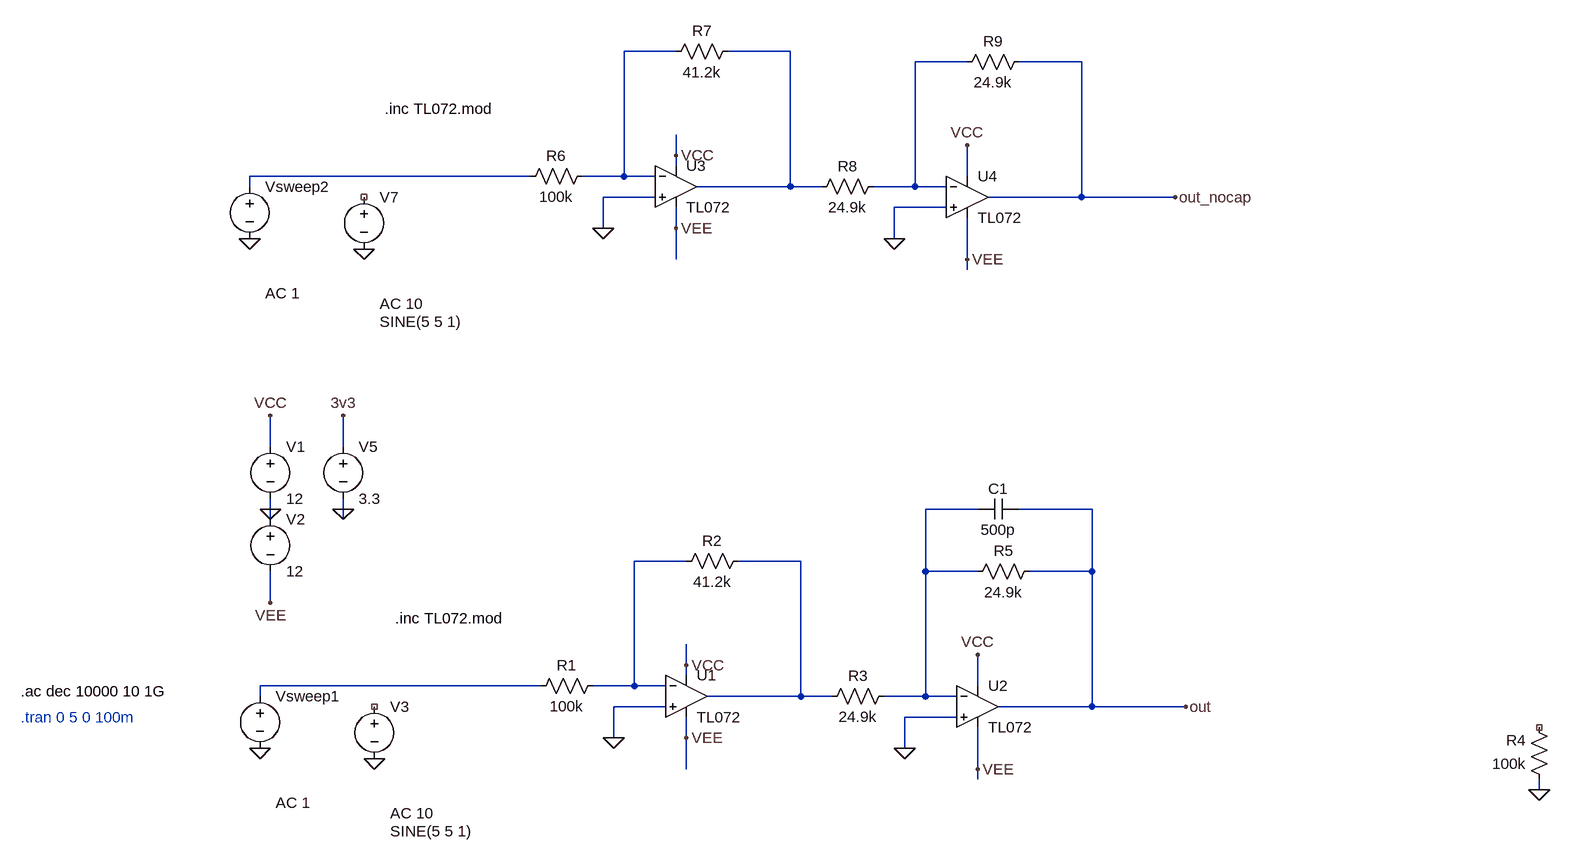
[diagram p0: schematic CV_in.asc]
CV_in.asc, the LTspice schematic file:
Version 4
SHEET 1 1540 680
WIRE 192 -832 112 -832
WIRE 368 -832 272 -832
WIRE 640 -816 560 -816
WIRE 816 -816 720 -816
WIRE 192 -672 192 -704
WIRE 192 -656 192 -672
WIRE -32 -640 -464 -640
WIRE 112 -640 112 -832
WIRE 112 -640 48 -640
WIRE 160 -640 112 -640
WIRE 640 -640 640 -688
WIRE -464 -624 -464 -640
WIRE 368 -624 368 -832
WIRE 368 -624 224 -624
WIRE 416 -624 368 -624
WIRE 560 -624 560 -816
WIRE 560 -624 496 -624
WIRE 608 -624 560 -624
WIRE 160 -608 80 -608
WIRE 816 -608 816 -816
WIRE 816 -608 672 -608
WIRE 960 -608 816 -608
WIRE 608 -592 528 -592
WIRE 80 -560 80 -608
WIRE 192 -560 192 -592
WIRE 528 -544 528 -592
WIRE 192 -512 192 -560
WIRE 640 -512 640 -576
WIRE 640 -496 640 -512
WIRE -432 -224 -432 -272
WIRE -320 -224 -320 -272
WIRE -432 -128 -432 -144
WIRE -320 -128 -320 -144
WIRE 656 -128 576 -128
WIRE 832 -128 720 -128
WIRE -432 -112 -432 -128
WIRE -320 -112 -320 -128
WIRE 208 -48 128 -48
WIRE 384 -48 288 -48
WIRE 576 -32 576 -128
WIRE 656 -32 576 -32
WIRE 832 -32 832 -128
WIRE 832 -32 736 -32
WIRE -432 16 -432 -32
WIRE 208 112 208 80
WIRE 208 128 208 112
WIRE -16 144 -448 144
WIRE 128 144 128 -48
WIRE 128 144 64 144
WIRE 176 144 128 144
WIRE 656 144 656 96
WIRE -448 160 -448 144
WIRE 384 160 384 -48
WIRE 384 160 240 160
WIRE 432 160 384 160
WIRE 576 160 576 -32
WIRE 576 160 512 160
WIRE 624 160 576 160
WIRE 176 176 96 176
WIRE 832 176 832 -32
WIRE 832 176 688 176
WIRE 976 176 832 176
WIRE 624 192 544 192
WIRE 96 224 96 176
WIRE 208 224 208 192
WIRE 544 240 544 192
WIRE 208 272 208 224
WIRE 656 272 656 208
WIRE 656 288 656 272
WIRE 1520 304 1520 288
FLAG -432 -128 0
FLAG -432 -272 VCC
FLAG -432 16 VEE
FLAG 208 112 VCC
FLAG 208 224 VEE
FLAG 96 224 0
FLAG -448 240 0
FLAG -272 256 0
FLAG 1520 304 0
FLAG 544 240 0
FLAG -320 -128 0
FLAG -320 -272 3v3
FLAG 656 272 VEE
FLAG 656 96 VCC
FLAG 192 -672 VCC
FLAG 192 -560 VEE
FLAG 80 -560 0
FLAG -464 -544 0
FLAG -288 -528 0
FLAG 528 -544 0
FLAG 640 -512 VEE
FLAG 640 -688 VCC
FLAG 976 176 out
FLAG 960 -608 out_nocap
DATAFLAG 912 176 ""
SYMBOL Opamps\\opamp2 208 96 R0
SYMATTR InstName U1
SYMATTR Value TL072
SYMBOL voltage -432 -240 R0
WINDOW 123 0 0 Left 0
WINDOW 39 0 0 Left 0
SYMATTR InstName V1
SYMATTR Value 12
SYMBOL voltage -432 -128 R0
WINDOW 123 0 0 Left 0
WINDOW 39 0 0 Left 0
SYMATTR InstName V2
SYMATTR Value 12
SYMBOL res 80 128 R90
WINDOW 0 0 56 VBottom 2
WINDOW 3 32 56 VTop 2
SYMATTR InstName R1
SYMATTR Value 100k
SYMBOL res 304 -64 R90
WINDOW 0 0 56 VBottom 2
WINDOW 3 32 56 VTop 2
SYMATTR InstName R2
SYMATTR Value 41.2k
SYMBOL voltage -448 144 R0
WINDOW 3 24 152 Left 2
WINDOW 123 24 180 Left 2
WINDOW 39 0 0 Left 0
SYMATTR Value ""
SYMATTR Value2 AC 1
SYMATTR InstName Vsweep1
SYMBOL voltage -272 160 R0
WINDOW 3 24 208 Left 2
WINDOW 123 24 180 Left 2
WINDOW 39 0 0 Left 0
SYMATTR Value SINE(5 5 1)
SYMATTR Value2 AC 10
SYMATTR InstName V3
SYMBOL res 1536 304 R180
WINDOW 0 36 76 Left 2
WINDOW 3 36 40 Left 2
SYMATTR InstName R4
SYMATTR Value 100k
SYMBOL res 528 144 R90
WINDOW 0 0 56 VBottom 2
WINDOW 3 32 56 VTop 2
SYMATTR InstName R3
SYMATTR Value 24.9k
SYMBOL res 752 -48 R90
WINDOW 0 0 56 VBottom 2
WINDOW 3 32 56 VTop 2
SYMATTR InstName R5
SYMATTR Value 24.9k
SYMBOL cap 720 -144 R90
WINDOW 0 0 32 VBottom 2
WINDOW 3 32 32 VTop 2
SYMATTR InstName C1
SYMATTR Value 500p
SYMBOL voltage -320 -240 R0
WINDOW 123 0 0 Left 0
WINDOW 39 0 0 Left 0
SYMATTR InstName V5
SYMATTR Value 3.3
SYMBOL Opamps\\opamp2 656 112 R0
SYMATTR InstName U2
SYMATTR Value TL072
SYMBOL Opamps\\opamp2 192 -688 R0
SYMATTR InstName U3
SYMATTR Value TL072
SYMBOL res 64 -656 R90
WINDOW 0 0 56 VBottom 2
WINDOW 3 32 56 VTop 2
SYMATTR InstName R6
SYMATTR Value 100k
SYMBOL res 288 -848 R90
WINDOW 0 0 56 VBottom 2
WINDOW 3 32 56 VTop 2
SYMATTR InstName R7
SYMATTR Value 41.2k
SYMBOL voltage -464 -640 R0
WINDOW 3 24 152 Left 2
WINDOW 123 24 180 Left 2
WINDOW 39 0 0 Left 0
SYMATTR Value ""
SYMATTR Value2 AC 1
SYMATTR InstName Vsweep2
SYMBOL voltage -288 -624 R0
WINDOW 3 24 208 Left 2
WINDOW 123 24 180 Left 2
WINDOW 39 0 0 Left 0
SYMATTR Value SINE(5 5 1)
SYMATTR Value2 AC 10
SYMATTR InstName V7
SYMBOL res 512 -640 R90
WINDOW 0 0 56 VBottom 2
WINDOW 3 32 56 VTop 2
SYMATTR InstName R8
SYMATTR Value 24.9k
SYMBOL res 736 -832 R90
WINDOW 0 0 56 VBottom 2
WINDOW 3 32 56 VTop 2
SYMATTR InstName R9
SYMATTR Value 24.9k
SYMBOL Opamps\\opamp2 640 -672 R0
SYMATTR InstName U4
SYMATTR Value TL072
TEXT -240 40 Left 2 !.inc TL072.mod
TEXT -816 152 Left 2 !.ac dec 10000 10 1G
TEXT -816 192 Left 2 ;.tran 0 5 0 100m
TEXT -256 -744 Left 2 !.inc TL072.mod

The netlist it stands for:
* CV_in.asc
XU1 0 N006 VCC VEE N007 TL072  ; pins In+ In- V+ V- OUT
V1 VCC 0 12
V2 0 VEE 12
R1 N006 N008 100k
R2 N007 N006 41.2k
Vsweep1 N008 0 AC 1
V3 NC_01 0 SINE(5 5 1) AC 10
R4 0 NC_02 100k
R3 N005 N007 24.9k
R5 out N005 24.9k
C1 out N005 500p
V5 3v3 0 3.3
XU2 0 N005 VCC VEE out TL072  ; pins In+ In- V+ V- OUT
XU3 0 N001 VCC VEE N002 TL072  ; pins In+ In- V+ V- OUT
R6 N001 N004 100k
R7 N002 N001 41.2k
Vsweep2 N004 0 AC 1
V7 NC_03 0 SINE(5 5 1) AC 10
R8 N003 N002 24.9k
R9 out_nocap N003 24.9k
XU4 0 N003 VCC VEE out_nocap TL072  ; pins In+ In- V+ V- OUT
.inc TL072.mod
.ac dec 10000 10 1G
* .tran 0 5 0 100m
.inc TL072.mod
.backanno
.end